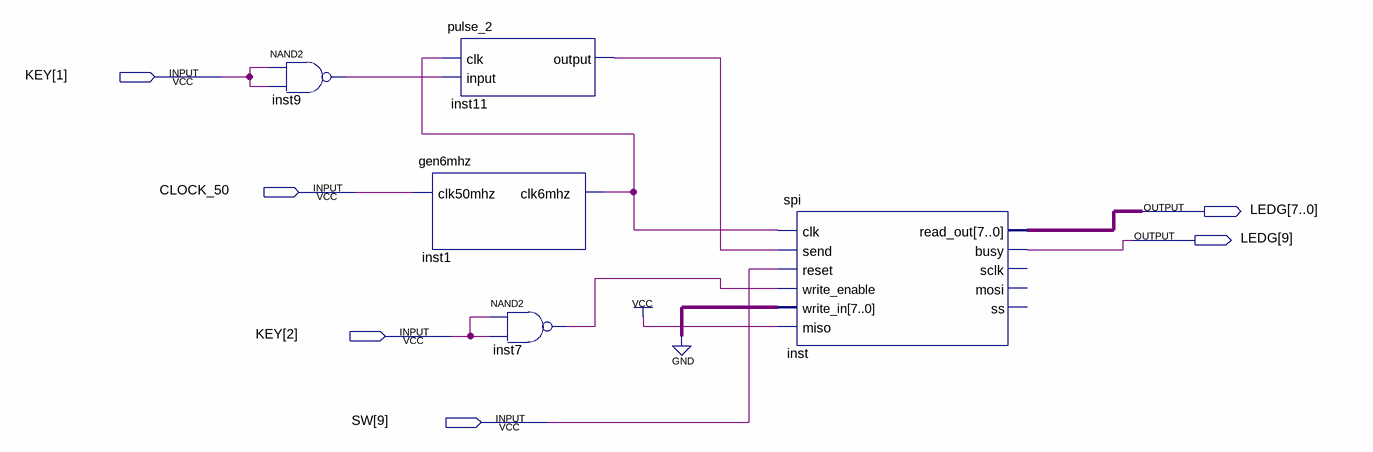
[diagram p0: schematic sheet]
// Quartus schematic top_de1.bdf as structural Verilog: 5 symbols, 6 pins
module top_de1 (
  input  [2:1] KEY,
  input  CLOCK_50,
  input  [9:9] SW,
  output [9:0] LEDG
);

  wire inst1_clk6mhz, inst7_out, inst9_out, inst11_output;

  nand inst9 (inst9_out, KEY[1], KEY[1]);
  pulse_2 inst11 (.clk(inst1_clk6mhz), .\input (inst9_out), .\output (inst11_output));
  gen6mhz inst1 (.clk50mhz(CLOCK_50), .clk6mhz(inst1_clk6mhz));
  nand inst7 (inst7_out, KEY[2], KEY[2]);
  spi inst (
    .clk(inst1_clk6mhz), .send(inst11_output), .reset(SW[9]), .write_enable(inst7_out), .write_in({8{1'b0}}),
    .miso(1'b1), .read_out(LEDG[7:0]), .busy(LEDG[9]));  // open: sclk, mosi, ss
endmodule
